# EAGLE design TTL640x480 (EAGLE 9.4.2)
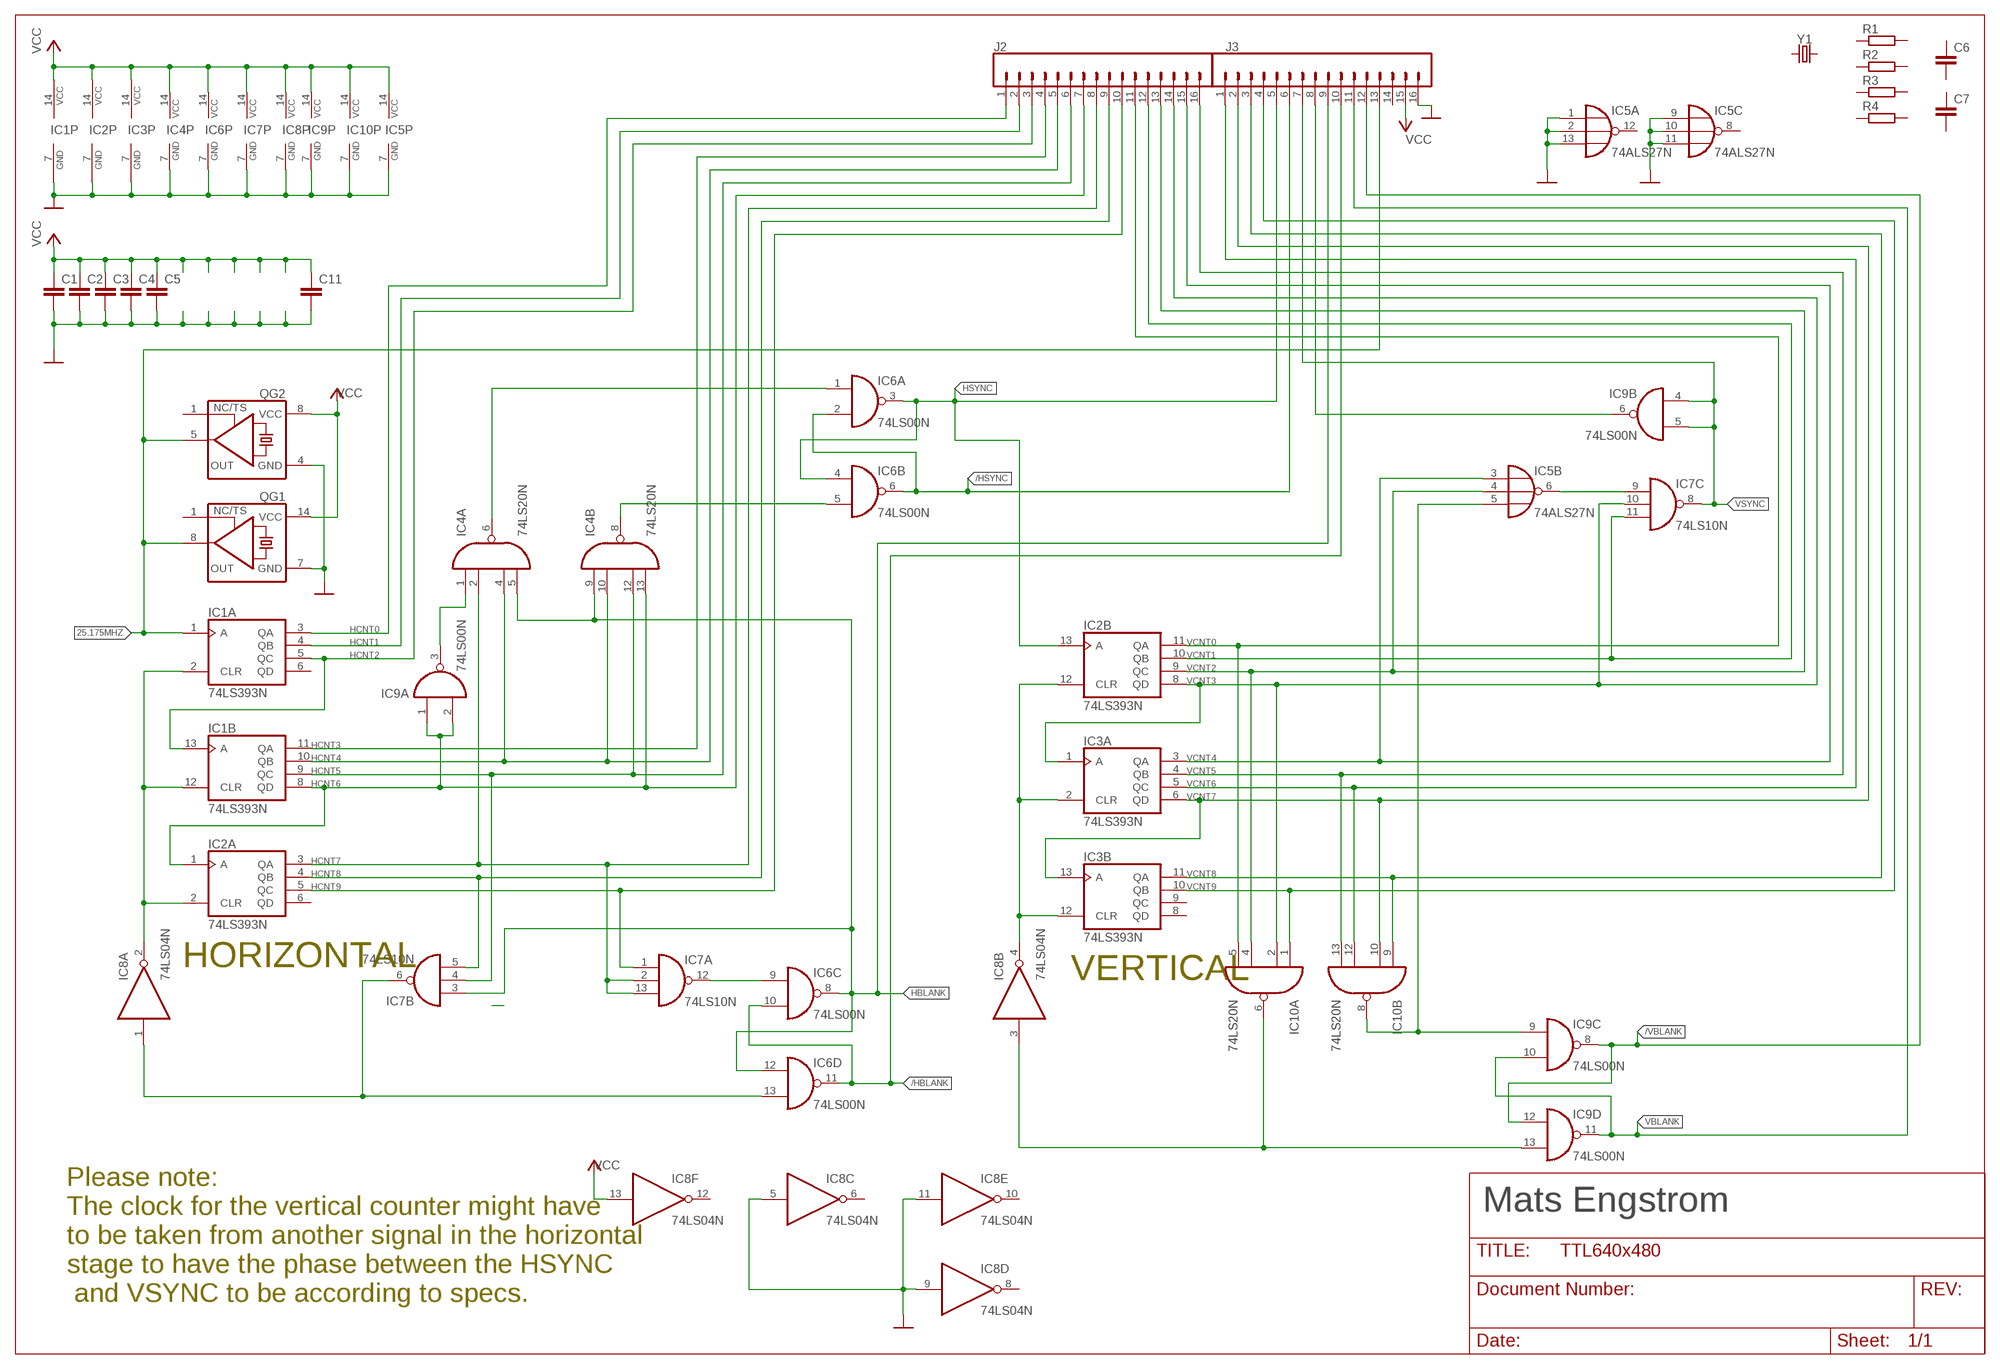
[diagram p0: schematic, sheet 1]

## Parts
C1  C-EU050-024X044  [C050-024X044]
C2  C-EU050-024X044  [C050-024X044]
C3  C-EU050-024X044  [C050-024X044]
C4  C-EU050-024X044  [C050-024X044]
C5  C-EU050-024X044  [C050-024X044]
C6  C-EU050-024X044  [C050-024X044]
C7  C-EU050-024X044  [C050-024X044]
C11  C-EU050-024X044  [C050-024X044]
IC1  74LS393N  [DIL14]
IC2  74LS393N  [DIL14]
IC3  74LS393N  [DIL14]
IC4  74LS20N  [DIL14]
IC5  74ALS27N  [DIL14]
IC6  74LS00N  [DIL14]
IC7  74LS10N  [DIL14]
IC8  74LS04N  [DIL14]
IC9  74LS00N  [DIL14]
IC10  74LS20N  [DIL14]
J2  CONN_16  [1X16]
J3  CONN_16  [1X16]
QG1  XO-14  [DIL14S]
QG2  XO-8  [DIL08S]
R1  R-EU_0204/2V  [0204V]
R2  R-EU_0204/2V  [0204V]
R3  R-EU_0204/2V  [0204V]
R4  R-EU_0204/2V  [0204V]
Y1  CRYSTALPTH-HC49US  [HC49US]

## Nets
25.175MHZ: IC1.1(A:A) J3.13 QG1.8(OUT) QG2.5(OUT)
/HBLANK: IC6.10(C:I1) IC6.11(D:O) J3.10
/HSYNC: IC6.2(A:I1) IC6.6(B:O) J3.6
/VBLANK: IC9.8(C:O) IC9.12(D:I0) J3.12
GND: C1.2 C2.2 C3.2 C4.2 C5.2 C11.2 IC1.7(P:GND) IC2.7(P:GND) IC3.7(P:GND) IC4.7(P:GND) IC5.1(A:I0) IC5.2(A:I1) IC5.7(P:GND) IC5.9(C:I0) IC5.10(C:I1) IC5.11(C:I2) IC5.13(A:I2) IC6.7(P:GND) IC7.7(P:GND) IC8.5(C:I) IC8.7(P:GND) IC8.9(D:I) IC8.11(E:I) IC9.7(P:GND) IC10.7(P:GND) J3.16 QG1.7(GND) QG2.4(GND)
HBLANK: IC4.5(A:I3) IC4.9(B:I0) IC6.8(C:O) IC6.12(D:I0) IC7.3(B:I0) J3.9
HCNT0: IC1.3(A:QA) J2.1
HCNT1: IC1.4(A:QB) J2.2
HCNT2: IC1.5(A:QC) IC1.13(B:A) J2.3
HCNT3: IC1.11(B:QA) J2.4
HCNT4: IC1.10(B:QB) IC4.4(A:I2) IC4.10(B:I1) J2.5
HCNT5: IC1.9(B:QC) IC4.12(B:I2) IC7.4(B:I1) J2.6
HCNT6: IC1.8(B:QD) IC2.1(A:A) IC4.13(B:I3) IC9.1(A:I0) IC9.2(A:I1) J2.7
HCNT7: IC2.3(A:QA) IC4.2(A:I1) IC7.2(A:I1) IC7.13(A:I2) J2.8
HCNT8: IC2.4(A:QB) IC7.5(B:I2) J2.9
HCNT9: IC2.5(A:QC) IC7.1(A:I0) J2.10
HSYNC: IC2.13(B:A) IC6.3(A:O) IC6.4(B:I0) J3.5
N$1: IC9.6(B:O) J3.8
N$2: IC4.1(A:I0) IC9.3(A:O)
N$3: IC1.2(A:CLR) IC1.12(B:CLR) IC2.2(A:CLR) IC8.2(A:O)
N$4: IC5.5(B:I2) IC9.9(C:I0) IC10.8(B:O)
N$5: IC5.6(B:O) IC7.9(C:I0)
N$6: IC2.12(B:CLR) IC3.2(A:CLR) IC3.12(B:CLR) IC8.4(B:O)
N$8: IC8.3(B:I) IC9.13(D:I1) IC10.6(A:O)
N$10: IC4.6(A:O) IC6.1(A:I0)
N$11: IC4.8(B:O) IC6.5(B:I1)
N$12: IC6.9(C:I0) IC7.12(A:O)
N$13: IC6.13(D:I1) IC7.6(B:O) IC8.1(A:I)
VBLANK: IC9.10(C:I1) IC9.11(D:O) J3.11
VCC: C1.1 C2.1 C3.1 C4.1 C5.1 C11.1 IC1.14(P:VCC) IC2.14(P:VCC) IC3.14(P:VCC) IC4.14(P:VCC) IC5.14(P:VCC) IC6.14(P:VCC) IC7.14(P:VCC) IC8.13(F:I) IC8.14(P:VCC) IC9.14(P:VCC) IC10.14(P:VCC) J3.15 QG1.14(VCC) QG2.8(VCC)
VCNT0: IC2.11(B:QA) IC10.5(A:I3) J2.11
VCNT1: IC2.10(B:QB) IC7.11(C:I2) J2.12
VCNT2: IC2.9(B:QC) IC5.4(B:I1) IC10.4(A:I2) J2.13
VCNT3: IC2.8(B:QD) IC3.1(A:A) IC7.10(C:I1) IC10.2(A:I1) J2.14
VCNT4: IC3.3(A:QA) IC5.3(B:I0) J2.15
VCNT5: IC3.4(A:QB) IC10.13(B:I3) J2.16
VCNT6: IC3.5(A:QC) IC10.12(B:I2) J3.1
VCNT7: IC3.6(A:QD) IC3.13(B:A) IC10.10(B:I1) J3.2
VCNT8: IC3.11(B:QA) IC10.9(B:I0) J3.3
VCNT9: IC3.10(B:QB) IC10.1(A:I0) J3.4
VSYNC: IC7.8(C:O) IC9.4(B:I0) IC9.5(B:I1) J3.7
Unconnected: C6.1 C6.2 C7.1 C7.2 IC1.6(A:QD) IC2.6(A:QD) IC3.8(B:QD) IC3.9(B:QC) IC5.8(C:O) IC5.12(A:O) IC8.6(C:O) IC8.8(D:O) IC8.10(E:O) IC8.12(F:O) J3.14 QG1.1(TS) QG2.1(TS) R1.1 R1.2 R2.1 R2.2 R3.1 R3.2 R4.1 R4.2 Y1.1 Y1.2

## Notes on the sheet
- HORIZONTAL
- VERTICAL
- Mats Engstrom
- Please note: 
  The clock for the vertical counter might have 
  to be taken from another signal in the horizontal 
  stage to have the phase between the HSYNC
   and VSYNC to be according to specs.

## Library data of the parts
C1-C7 C11 = rcl:C-EU: CAPACITOR, European symbol; SPICEPREFIX: C
IC1-IC3 = 74xx-us:74*393: Dual 4-bit decade and binary COUNTER
IC4 IC10 = 74xx-eu:74*20: Dual 4-input NAND gate
IC5 = 74xx-eu:74*27: Triple 3-input NOR gate
IC6 IC9 = 74xx-eu:74*00: Quad 2-input NAND gate
IC7 = 74xx-eu:74*10: Triple 3-input NAND gate
IC8 = 74xx-eu:74*04: Hex INVERTER
J2 J3 = SparkFun-Connectors:CONN_16: Multi connection point. Often used as Generic Header-pin footprint for 0.1 inch spaced/style header connections On any of the 0.1 inch spaced packages, you can populate with these: Break Away Headers - Straight <https://www.sparkfun.com/products/116> (PRT-00116) Break Away Male Headers - Right Angle <https://www.sparkfun.com/products/553> (PRT-00553) Female Headers <https://www.sparkfun.com/products/115> (PRT-00115) Break Away Headers - Machine Pin <https://www.sparkfun.com/products/117> (PRT-00117) Break Away Female Headers - Swiss Machine Pin <https://www.sparkfun.com/products/743> (PRT-00743) For SCREWTERMINALS and SPRING TERMINALS visit here: Screw Terimnals on SparkFun.com <https://www.sparkfun.com/search/results?term=Screw+Terminals> (5mm/3.5mm/2.54mm spacing) This device is also useful as a general connection point to wire up your design to another part of your project. Our various solder wires solder well into these plated through hole pads. Hook-Up Wire - Assortment (Stranded, 22 AWG) <https://www.sparkfun.com/products/11375> (PRT-11375) Hook-Up Wire - Assortment (Solid Core, 22 AWG) <https://www.sparkfun.com/products/11367> (PRT-11367) View the entire wire category on our website here <https://www.sparkfun.com/categories/141> Special notes: Molex polarized connector foot print use with SKU : PRT-08231 with associated crimp pins and housings. 1MM SMD Version SKU: PRT-10208 NOTES ON THE VARIANTS LOCK and LOCK_LONGPADS... This footprint was designed to help hold the alignment of a through-hole component (i.e. 6-pin header) while soldering it into place. You may notice that each hole has been shifted either up or down by 0.005 of an inch from it's more standard position (which is a perfectly straight line). This slight alteration caused the pins (the squares in the middle) to touch the edges of the holes. Because they are alternating, it causes a "brace" to hold the component in place. 0.005 has proven to be the perfect amount of "off-center" position when using our standard breakaway headers. Although looks a little odd when you look at the bare footprint, once you have a header in there, the alteration is very hard to notice. Also,if you push a header all the way into place, it is covered up entirely on the bottom side.
QG1 QG2 = crystal:XO-: CRYSTAL; OC_FARNELL: unknown; OC_NEWARK: unknown
R1-R4 = rcl:R-EU_: RESISTOR, European symbol; SPICEPREFIX: R
Y1 = SparkFun-Clocks:CRYSTAL: Crystals (Generic) These are passive quartz crystals, which can be used as a clock source for a microcontroller. Crystal's are two-terminal devices. They require external "load" capacitors to generate an oscillating signal.

## Board
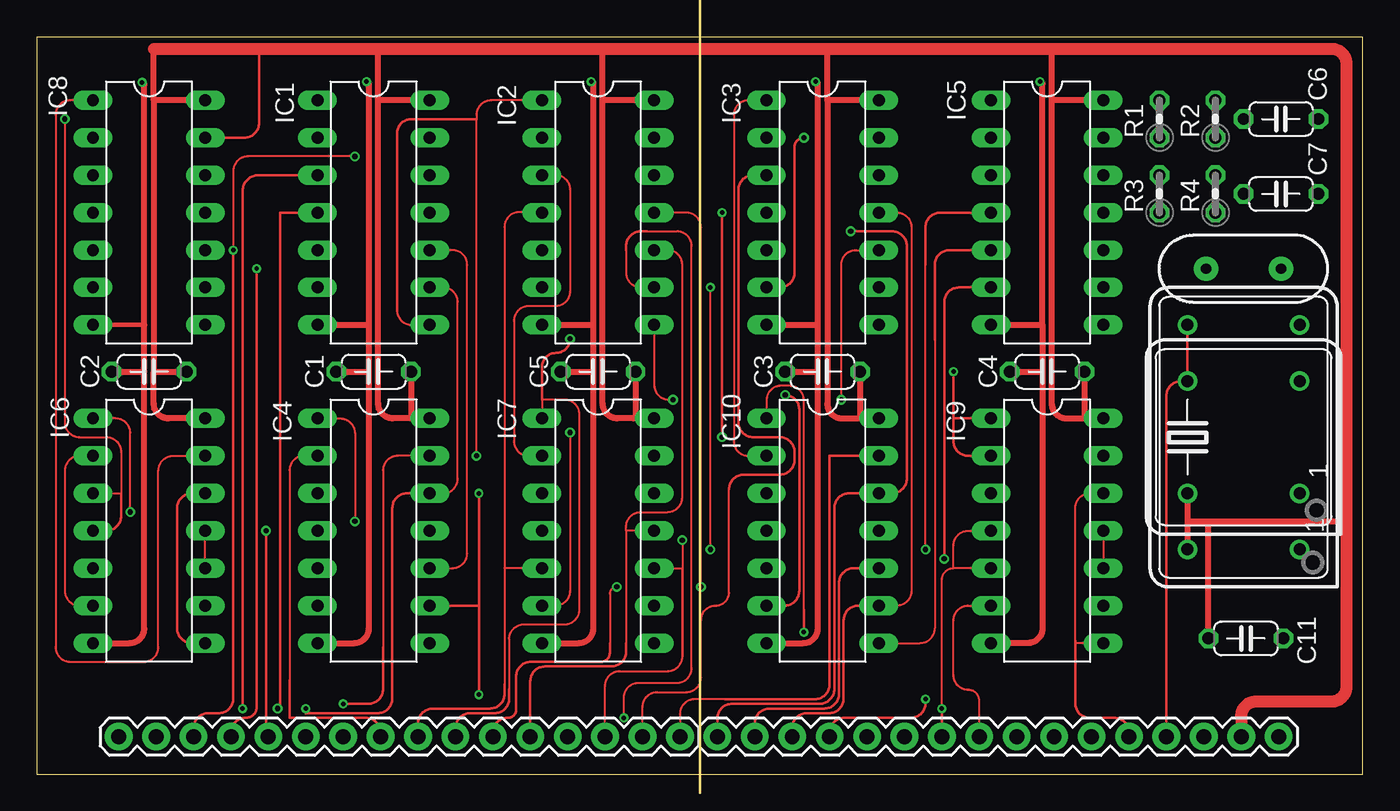
[diagram p1: board, top side]
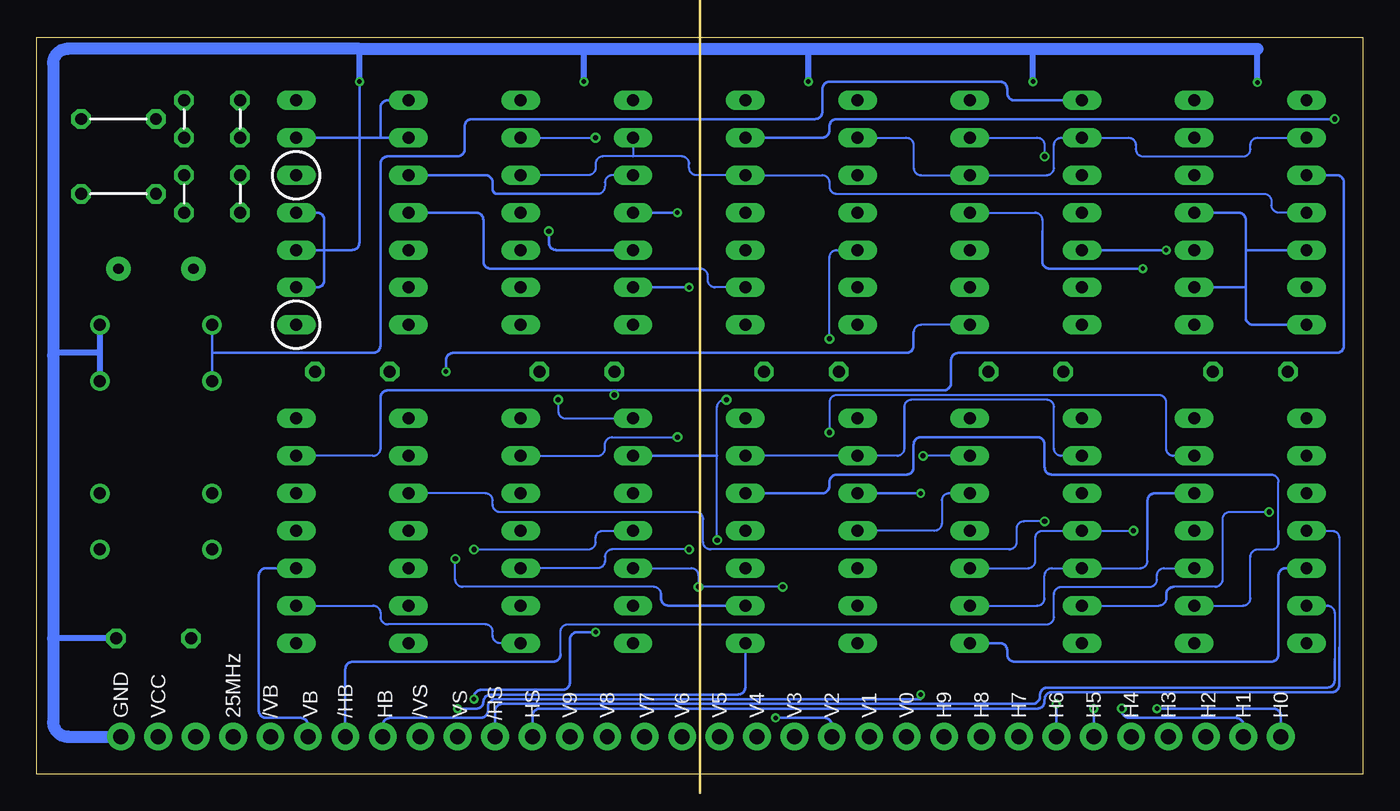
[diagram p2: board, bottom side, seen from below]

Size 90 x 50 mm. Coordinates in mm from the lower left corner, seen from the top.
Outline: 0,0 90,0 90,50 0,50 0,0
Copper layers (1*16): Top 0.035mm / dielectric 1.5mm / Bottom 0.035mm
Design rules "dirt_cheap_dirty_boards.v1.1": minimum track width 6mil, minimum drill 12mil, track to track 6mil, track to pad 6mil, pad to pad 6mil, via to via 6mil, smd to smd 0mil, copper to edge 10mil, drill to drill 10mil, minimum pad ring 10mil, minimum via ring 6mil, stop-mask expansion 2mil, vias tented up to drill 25mil, thermal gap 10mil
Milling: 1 lines

### Footprints (pad centres in the part's own frame; a part is rotated, then mirrored left to right if it is on the bottom)
C050-024X044 = drill 0.813 octagon: 1 -2.54,0; 2 2.54,0
DIL14 = drill 0.813 long: 1 -7.62,-3.81; 2 -5.08,-3.81; 3 -2.54,-3.81; 4 0,-3.81; 5 2.54,-3.81; 6 5.08,-3.81; 7 7.62,-3.81; 8 7.62,3.81; 9 5.08,3.81; 10 2.54,3.81; 11 0,3.81; 12 -2.54,3.81; 13 -5.08,3.81; 14 -7.62,3.81
1X16 = drill 1.016 pad 1.88: 1 0,0; 2 2.54,0; 3 5.08,0; 4 7.62,0; 5 10.16,0; 6 12.7,0; 7 15.24,0; 8 17.78,0; 9 20.32,0; 10 22.86,0; 11 25.4,0; 12 27.94,0; 13 30.48,0; 14 33.02,0; 15 35.56,0; 16 38.1,0
DIL14S = drill 0.813: 1 -7.62,-3.81; 7 7.62,-3.81; 8 7.62,3.81; 14 -7.62,3.81
DIL08S = drill 0.813: 1 -3.81,-3.81; 4 3.81,-3.81; 5 3.81,3.81; 8 -3.81,3.81
0204V = drill 0.813 octagon: 1 -1.27,0; 2 1.27,0
HC49US = drill 0.7 pad 1.651: 1 -2.54,0; 2 2.54,0

### Placement (x,y rotation side)
C1  22.86,27.3 180 top
C2  7.62,27.3 180 top
C3  53.34,27.3 180 top
C4  68.58,27.3 180 top
C5  38.1,27.3 180 top
C6  84.45,44.45 180 top
C7  84.45,39.37 0 top
C11  82.07,9.21 0 top
IC1  22.86,38.1 270 top
IC2  38.1,38.1 270 top
IC3  53.34,38.1 270 top
IC4  22.86,16.51 270 top
IC5  68.58,38.1 270 top
IC6  7.62,16.51 270 top
IC7  38.1,16.51 270 top
IC8  7.62,38.1 270 top
IC9  68.58,16.51 270 top
IC10  53.34,16.51 270 top
J2  5.56,2.54 0 top
J3  46.2,2.54 0 top
QG1  81.92,22.86 90 top
QG2  81.92,22.86 90 top
R1  76.2,44.45 90 top
R2  80.01,44.45 90 top
R3  76.2,39.37 90 top
R4  80.01,39.37 90 top
Y1  81.92,34.29 180 top

### Tracks (layer width: path | path; a pad name or v marks a point on that pad's centre or on a via)
25.175MHZ
  Top 0.159: QG1.8 QG2.5 77.68,26.67 arc90 76.68,25.67 J3.13
  Bottom 0.159: IC1.1 23.63,45.72 arc90 24.13,46.22 24.13,46.49 arc-90 24.63,46.99 36.17,46.99 arc-90 36.67,46.49 36.67,44.95 arc90 37.17,44.45 60.46,44.45 arc-90 60.96,43.95 60.96,42.41 arc90 61.46,41.91 66.17,41.91 arc-90 66.67,41.41 66.67,29.07 arc90 67.17,28.57 78.11,28.57 | 78.11,28.57 QG2.5 | 78.11,28.57 QG1.8
/HBLANK
  Top 0.152: IC6.10 IC6.11
  Bottom 0.152: IC6.10 13.47,13.97 arc-90 13.97,13.47 13.97,13.2 arc90 14.47,12.7 20.45,12.7 arc-90 20.95,12.2 20.95,10.66 arc90 21.45,10.16 53.95,10.16 arc-90 54.45,9.66 54.45,8.12
  Bottom 0.159: 54.45,8.12 arc90 54.95,7.62 68.56,7.62 arc-90 69.06,7.12 J3.10
/HSYNC
  Top 0.152: IC6.6 2.9,11.43 arc-90 1.91,12.43 1.91,20.59 arc-90 2.9,21.59 IC6.2
  Bottom 0.152: IC6.6 2.4,11.43 arc90 1.91,10.93 1.91,7.8
  Bottom 0.159: J3.6 58.9,4.26 arc90 58.4,4.76 22.4,4.76 arc-90 21.9,5.26 21.9,5.37 arc90 21.4,5.87 2.4,5.87 arc-90 1.91,6.37 1.91,7.8
/VBLANK
  Top 0.152: IC9.12 71.48,19.05 arc90 70.48,18.05 70.48,9.05 70.48,8.89 IC9.8
  Top 0.159: 70.48,9.05 70.48,4.81 arc90 71.48,3.81 73.14,3.81 arc-90 74.14,2.81 J3.12
GND  (via drill 0.3)
  Top 0.305: IC8.7 7.3,30.48
  Top 0.406: IC6.7 6.3,8.89 arc90 7.3,9.89 7.3,27.3 | 7.3,27.3 7.3,30.48 7.3,46.77 arc90 v7.14,46.93 | IC4.7 21.54,8.89 arc90 22.54,9.89 22.54,27.3 | 22.54,27.3 22.54,30.48 | IC7.7 36.78,8.89 arc90 37.78,9.89 37.78,27.3 | 37.78,27.3 37.78,30.48 | IC10.7 52.02,8.89 arc90 53.02,9.89 53.02,27.3 | 53.02,27.3 53.02,30.48 | IC1.7 22.54,30.48 | IC2.7 37.78,30.48 | IC3.7 53.02,30.48 | 68.26,27.3 68.26,9.89 arc-90 67.26,8.89 IC9.7 | 68.26,30.48 68.26,27.3 | C2.2 7.3,27.3 | C1.2 22.54,27.3 | C5.2 37.78,27.3 | C3.2 53.02,27.3 | C4.2 68.26,27.3 | IC5.7 68.26,30.48 | 68.26,30.48 68.26,46.83 arc90 v68.1,46.99 | 53.02,30.48 53.02,46.83 arc90 v52.86,46.99 | 37.78,30.48 37.78,46.83 arc90 v37.62,46.99 | 22.54,30.48 22.54,46.83 arc90 v22.38,46.99
  Bottom 0.159: 88.9,28.57 88.9,28.42 | IC8.11 8.44,38.1 arc90 7.94,37.6 7.94,35.56 | 7.94,35.56 7.94,33.02 | 7.94,33.02 IC8.9 | IC8.7 7.44,30.48 arc90 7.94,30.98 7.94,33.02 | IC8.5 7.94,35.56 | IC5.11 70.98,38.1 arc90 70.48,37.6 70.48,35.56 | 70.48,35.56 70.48,33.52 arc90 70.98,33.02 IC5.9 | IC5.10 70.48,35.56 | IC5.1 66.17,45.72 arc-90 66.67,45.22 66.67,43.18 | 66.67,43.18 IC5.2 | IC5.13 68.1,43.18 | 68.1,43.18 66.67,43.18 | v68.1,46.99 68.1,43.18 | 70.48,35.56 68.6,35.56 arc-90 68.1,36.06 68.1,43.18
  Bottom 0.406: v68.1,46.99 68.1,49.21 | v52.86,46.99 52.86,49.21 | v37.62,46.99 37.62,49.21 | v22.38,46.99 22.38,49.21 | v7.14,46.93 7.14,49.21 | QG1.7 85.72,28.57 | 85.72,28.57 QG2.4 | 85.72,28.57 88.9,28.57 | C11.2 88.9,9.21
  Bottom 0.813: 7.14,49.21 22.38,49.21 37.62,49.21 52.86,49.21 68.1,49.21 87.9,49.21 arc-90 88.9,48.21 88.9,28.42 88.9,9.21 88.9,3.54 arc-90 87.9,2.54 J3.16
HBLANK  (via drill 0.3)
  Top 0.159: IC6.12 10.53,19.05 arc90 9.53,18.05 9.53,9.89 arc90 10.53,8.89 IC6.8 | v30,19.05 30,11.43 | 30,11.43 v30,5.4 | IC4.9 30,11.43
  Bottom 0.152: 14.61,15.24 14.61,14.47 arc90 15.11,13.97 IC4.5 21.09,13.97 arc-90 21.59,13.47 21.59,11.93 arc90 22.09,11.43 IC4.9
  Bottom 0.159: IC6.12 14.11,19.05 arc-90 14.61,18.55 14.61,15.24 | v30,19.05 IC7.3 | J3.9 66.52,3.31 arc90 66.02,3.81 59.87,3.81 arc-90 59.37,4.31 59.37,4.58 arc90 58.87,5.08 30,5.08 v30,5.4
HCNT0  (via drill 0.3)
  Top 0.159: IC1.3 14.97,40.64 arc90 13.97,39.48 v13.97,4.45
  Bottom 0.159: v13.97,4.45 6.06,4.45 arc90 5.56,3.94 J2.1
HCNT1  (via drill 0.35)
  Top 0.152: IC1.4 18.89,38.1
  Top 0.159: v16.35,4.45 16.51,4.45 16.51,38.1 18.89,38.1
  Bottom 0.159: v16.35,4.45 16.35,4.31 arc-90 15.85,3.81 8.6,3.81 arc90 8.1,3.31 J2.2
HCNT2  (via drill 0.3, 0.35)
  Top 0.152: v21.59,41.91 14.34,41.91 arc90 13.34,40.91 v13.34,35.56
  Top 0.159: J2.3 10.64,3.13 arc-90 11.64,4.13 12.34,4.13 arc90 13.34,5.13 v13.34,35.56
  Bottom 0.152: IC1.13 22.09,43.18 arc90 21.59,42.68 v21.59,41.91
  Bottom 0.159: IC1.5 v13.34,35.56
HCNT3  (via drill 0.3)
  Top 0.159: J2.4 13.18,2.81 arc-90 14.18,3.81 arc90 14.92,4.56 v14.92,34.29
  Bottom 0.152: IC1.11 22.25,38.1 arc90 21.75,37.6 21.75,36.83
  Bottom 0.159: 21.75,36.83 21.75,34.79 arc-90 21.25,34.29 v14.92,34.29
HCNT4  (via drill 0.35)
  Top 0.152: IC1.10 28.21,35.56 arc-90 29.21,34.56 29.21,14.97 arc-90 28.21,13.97 IC4.10
  Top 0.159: J2.5 15.56,2.54 v15.56,16.51
  Bottom 0.152: v15.56,16.51 IC4.4 21.73,16.51 arc-90 22.23,16.01 22.23,14.47 arc90 22.73,13.97 IC4.10
HCNT5  (via drill 0.3)
  Top 0.152: IC1.9 27.57,33.02 arc-90 28.57,32.02 28.57,20.05 arc-90 27.57,19.05 IC4.12
  Top 0.159: IC4.12 25.13,19.05 arc90 24.13,18.05 24.13,5.13 arc-90 23.13,4.13 18.26,4.13 v18.26,4.45
  Bottom 0.152: IC7.4 29.07,16.51 arc-90 28.57,17.01 28.57,18.55 arc90 28.07,19.05 IC4.12
  Bottom 0.159: v18.26,4.45 J2.6
HCNT6  (via drill 0.3, 0.35)
  Top 0.152: IC4.13 24.5,21.59 arc90 23.5,20.59 23.5,8.62 | IC2.1 30.84,45.72 arc90 29.84,44.72 29.84,44.45 v29.84,21.59 | 24.45,31.48 arc90 25.45,30.48 IC1.8
  Top 0.159: IC9.2 63.23,21.59 arc-90 62.23,22.59 62.23,24.13 | 62.23,24.13 v62.23,27.3 | IC9.1 62.23,24.13 | 29.84,44.45 25.45,44.45 arc90 24.45,43.45 24.45,31.48 | 23.5,8.62 23.5,5.76 arc-90 22.5,4.76 v20.8,4.76
  Bottom 0.152: IC1.8 29.98,30.48 arc-90 30.48,29.98 | IC4.13 v29.84,21.59
  Bottom 0.159: 30.48,29.98 30.48,29.07 arc90 30.98,28.57 61.73,28.57 arc-90 62.23,28.07 v62.23,27.3 | J2.7 v20.8,4.76
HCNT7
  Top 0.152: IC7.2 33.38,21.59 arc-90 32.38,22.59 32.38,30.75 arc-90 33.38,31.75 35.2,31.75 arc90 36.2,32.75 36.2,39.66 arc89 35.22,40.66 34.29,40.68 arc-180 IC2.3 | IC4.2 18.14,21.59 arc90 17.14,20.59 17.14,6.35
  Top 0.159: 17.14,6.35 17.14,3.81 22.34,3.81 arc-90 23.34,2.81 J2.8
  Bottom 0.152: IC7.13 IC7.2 31.61,21.59 arc-90 31.11,22.09 | IC4.2 20.45,21.59 arc90 20.95,22.09 20.95,24.9 arc-90 21.45,25.4 30.61,25.4 arc-90 31.11,24.9
  Bottom 0.159: 31.11,24.9 31.11,22.09
HCNT8
  Top 0.152: 31.75,13.97 31.75,6.08 | IC7.5 31.75,13.97 | IC2.4 34.29,38.14 32.75,38.14 arc90 31.75,37.14 31.75,13.97
  Top 0.159: 31.75,6.08 31.75,5.45 arc-90 30.75,4.45 26.88,4.45 arc90 25.88,3.44 J2.9
HCNT9  (via drill 0.35)
  Top 0.152: 32.07,5.76 32.07,9.16 arc-90 33.07,10.16 35.83,10.16 arc90 36.83,11.16 36.83,24.4 arc90 35.83,25.4 34.29,25.4 IC7.1
  Top 0.159: v36.2,29.53 arc-90 35.24,28.57 arc90 34.29,27.62 34.29,25.4 | 32.07,5.76 32.07,5.13 arc-90 31.07,4.13 29.42,4.13 arc90 28.42,3.13 J2.10
  Bottom 0.152: v36.2,29.53 36.2,35.06 arc90 35.7,35.56 IC2.5
HSYNC  (via drill 0.35)
  Top 0.152: IC6.3 5.71,19.05 5.71,21.86 arc90 4.71,22.86 2.9,22.86 arc-90 1.91,23.86 v1.91,44.45
  Top 0.159: IC6.4 4.71,16.51 arc90 5.71,17.51 5.71,19.05
  Bottom 0.152: IC6.4 2.09,16.51 arc90 1.59,16.01 1.59,8.57
  Bottom 0.159: v1.91,44.45 35.7,44.45 arc-90 36.2,43.95 36.2,43.68 arc90 36.7,43.18 IC2.13 | J3.5 56.36,3.94 arc90 55.86,4.45 22.09,4.45 arc-90 21.59,4.95 21.59,5.06 arc90 21.09,5.56 2.09,5.56 arc-90 1.59,6.06 1.59,8.57
N$1
  Top 0.152: J3.8 63.98,4.97 arc90 63.23,5.71 arc-90 62.23,6.71 62.23,10.43 arc-90 63.23,11.43 IC9.6
N$2  (via drill 0.35)
  Top 0.152: IC4.1 20.59,24.13 arc-90 21.59,23.13 v21.59,17.14
  Bottom 0.152: IC9.3 59.55,19.05 arc90 59.05,18.55 59.05,18.28 arc-90 58.55,17.78 45.27,17.78 arc90 44.77,17.28 44.77,15.74 arc-90 44.27,15.24 24,15.24 arc-90 23.5,15.74 23.5,16.64 arc90 23,17.14 v21.59,17.14
N$3
  Bottom 0.152: IC2.2 30.98,43.18 arc90 30.48,42.68 30.48,41.14 arc-90 29.98,40.64 IC1.12 21.45,40.64 arc-90 20.95,41.14 20.95,42.68 arc90 20.45,43.18 IC1.2 15.9,43.18 arc90 15.4,42.68 15.4,42.41 arc-90 14.9,41.91 8.12,41.91 arc-90 7.62,42.41 7.62,42.68 arc90 7.12,43.18 IC8.2
N$4
  Top 0.152: 60.96,29.48 60.96,9.89 arc-90 59.96,8.89 IC10.8
  Top 0.159: IC5.5 61.96,35.56 arc90 60.96,34.56 60.96,29.48
  Bottom 0.152: IC10.8 58.55,8.89 arc90 59.05,9.39 59.05,9.66 arc-90 59.55,10.16 66.17,10.16 arc90 66.67,10.66 66.67,10.93 arc-90 67.17,11.43 IC9.9
N$5  (via drill 0.35)
  Top 0.159: v61.59,14.61 61.59,32.02 arc-90 62.59,33.02 IC5.6
  Bottom 0.152: 47.62,12.2 arc-90 48.12,12.7 61.09,12.7 arc90 61.59,13.2 v61.59,14.61
  Bottom 0.159: IC7.9 47.12,11.43 arc90 47.62,11.93 47.62,12.2
N$6
  Bottom 0.152: 49.53,41.91 46.22,41.91 arc90 45.72,41.41 45.72,41.14 arc-90 45.22,40.64 IC2.12 36.7,40.64 arc90 36.2,40.14 36.2,39.87 arc-90 35.7,39.37 6.69,39.37 arc90 6.19,38.87 6.19,38.6 arc-90 5.69,38.1 IC8.4 | 49.53,41.91 51.57,41.91 arc-90 52.07,41.41 52.07,41.14 arc90 52.57,40.64 IC3.12 | IC3.2 49.53,41.91
N$8  (via drill 0.35)
  Top 0.159: IC10.6 50.75,11.43 arc90 51.75,12.43 51.75,24.77 arc90 v50.8,25.72
  Bottom 0.152: 66.67,22.09 arc90 67.17,21.59 IC9.13
  Bottom 0.159: 50.8,26.04 28.44,26.04 arc-90 27.94,26.54 27.94,28.07 arc90 27.44,28.57 1.77,28.57 arc-90 1.27,29.07 1.27,40.14 arc-90 1.77,40.64 IC8.3 | v50.8,25.72 50.8,26.04 | 66.67,22.09 66.67,25.54 arc90 66.17,26.04 50.8,26.04
N$10  (via drill 0.35)
  Top 0.152: v6.35,17.78 6.35,23.13 arc90 5.35,24.13 IC6.1
  Bottom 0.152: IC4.6 13.84,11.43 arc-90 13.34,11.93 | v6.35,17.78 9.03,17.78 arc-90 9.53,17.28 9.53,13.2 arc90 10.03,12.7 12.84,12.7
  Bottom 0.159: 12.84,12.7 arc-90 13.34,12.2 13.34,11.93
N$11
  Bottom 0.159: IC6.5 5.21,13.97 arc-90 5.71,13.47 5.71,8.12 arc90 6.21,7.62 23.63,7.62 arc90 24.13,8.12 24.13,8.39 arc-90 24.63,8.89 IC4.8
N$12
  Bottom 0.152: 5.71,16.51 5.71,19.82 arc-90 6.21,20.32 | IC6.9 8.12,11.43 arc-90 7.62,11.93 7.62,14.74 arc90 7.12,15.24 6.17,15.24 arc-90 5.71,15.69
  Bottom 0.159: IC7.12 36.7,19.05 arc-90 36.2,19.55 36.2,19.82 arc90 35.7,20.32 30.98,20.32 arc-90 30.48,20.82 30.48,22.36 arc90 29.98,22.86 22.09,22.86 arc90 21.59,22.36 21.59,20.82 arc-90 21.09,20.32 6.21,20.32 | 5.71,15.69 5.71,16.51
N$13  (via drill 0.35)
  Top 0.152: IC8.1 2.27,45.72 arc90 1.27,44.72 1.27,8.62 arc90 2.27,7.62 7.25,7.62 arc90 8.26,8.62 8.26,20.59 arc-90 9.26,21.59 IC6.13 | v36.2,23.18 36.2,12.43 arc-90 35.2,11.43 IC7.6
  Bottom 0.152: v36.2,23.18 36.2,25.22 arc90 35.7,25.72 13.84,25.72 arc90 13.34,25.22 13.34,22.09 arc-90 12.84,21.59 IC6.13
VBLANK
  Top 0.152: IC9.11 IC9.10
  Bottom 0.152: 73.8,13.97 IC9.10
  Bottom 0.159: J3.11 71.6,3.31 arc-90 72.1,3.81 74.43,3.81 arc90 74.93,4.31 74.93,13.47 arc90 74.43,13.97 73.8,13.97
VCC
  Top 0.159: IC8.13 14.08,43.18 arc90 15.08,44.18 15.08,49.21
  Top 0.406: IC10.14 55.88,24.13 | 53.66,45.72 53.66,25.13 arc90 54.66,24.13 55.88,24.13 | IC7.14 40.48,24.13 | 40.48,24.13 39.42,24.13 arc-90 38.42,25.13 38.42,45.72 | IC4.14 25.4,24.13 | 25.4,24.13 24.18,24.13 arc-90 23.18,25.13 23.18,45.72 | IC6.14 8.94,24.13 arc-90 7.94,25.13 7.94,27.3 | 7.94,45.72 7.94,27.3 | IC9.14 71.12,24.13 | 68.9,45.72 68.9,25.13 arc90 69.9,24.13 71.12,24.13 | 7.94,27.3 C2.1 | C3.1 55.88,24.13 | C1.1 25.4,24.13 | C5.1 40.64,24.29 40.48,24.13 | C4.1 71.12,24.13 | IC5.14 68.9,45.72 | IC3.14 53.66,45.72 | IC2.14 38.42,45.72 | IC1.14 23.18,45.72 | IC8.14 7.94,45.72 | 68.9,45.72 68.9,49.21 69.06,49.21 | 7.94,45.72 7.94,49.21 | 23.18,45.72 23.18,49.21 | 38.42,45.72 38.42,49.21 | 53.66,45.72 53.66,49.21 | QG2.8 78.11,17.14 | 78.11,17.14 QG1.14 | 78.11,17.14 79.53,17.14 | 79.53,17.14 88.9,17.14 | C11.1 79.53,17.14
  Top 0.813: 7.94,49.21 15.08,49.21 23.18,49.21 38.42,49.21 53.66,49.21 69.06,49.21 87.9,49.21 arc-90 88.9,48.21 88.9,17.14 88.9,5.92 arc-90 87.9,4.92 82.76,4.92 arc90 81.76,3.92 J3.15
VCNT0  (via drill 0.35)
  Top 0.152: v39.37,12.7 arc90 38.89,12.22 38.89,8.89 | v45.09,12.7 45.09,37.1 arc90 44.09,38.1 IC2.11
  Top 0.159: 38.89,8.89 38.89,8.21 arc-90 38.31,7.62 33.54,7.62 arc90 32.54,6.62 32.54,4.4 arc-90 31.96,3.81 arc90 30.96,2.81 J2.11
  Bottom 0.152: v39.37,12.7 v45.09,12.7 45.09,13.47 arc-90 45.59,13.97 IC10.5
VCNT1
  Top 0.152: IC7.11 40.01,16.51 | 40.01,16.51 40.01,8.89 | IC2.10 42.81,35.56 arc-90 43.81,34.56 43.81,18.78 arc-90 42.81,17.78 41.01,17.78 arc90 40.01,16.78 40.01,16.51
  Top 0.159: 40.01,8.89 40.01,8.3 arc-90 39.01,7.3 34.5,7.3 arc90 33.5,6.3 J2.12
VCNT2  (via drill 0.3, 0.35)
  Top 0.152: v60.33,15.24 60.33,34.56 | 41.43,36.83 43.45,36.83 arc-90 44.45,35.83 44.45,7.19 arc-90 43.45,6.19 40.85,6.19 arc90 39.85,5.19 v39.85,3.81 | 40.01,35.56 40.01,34.02 arc90 41.01,33.02 IC2.9
  Top 0.159: 40.01,35.56 40.01,35.83 arc-90 41.01,36.83 41.43,36.83 | 60.33,34.56 60.33,37.1 arc-90 61.33,38.1 IC5.4
  Bottom 0.152: v60.33,15.24 52.57,15.24 arc-90 52.07,15.74 52.07,16.01 arc90 51.57,16.51 IC10.4 | IC2.9 43.95,33.02 arc90 44.45,33.52 44.45,33.79 arc-90 44.95,34.29
  Bottom 0.159: 44.95,34.29 59.19,34.29 arc90 59.69,34.79 59.69,37.6 arc-90 60.19,38.1 IC5.4 | v39.85,3.81 36.54,3.81 arc90 36.04,3.31 J2.13
VCNT3  (via drill 0.35)
  Top 0.152: IC3.1 48.31,45.72 arc90 47.31,44.72 47.31,22.59 arc90 48.31,21.59 IC10.2 | IC7.10 43.81,13.97 v43.82,15.87 v43.81,15.88 | IC2.8 41.91,26.4 arc90 42.91,25.4 v43.18,25.4 | J2.14 38.58,5.99 arc-90 39.58,6.99 42.82,6.99 arc90 43.82,7.99
  Top 0.159: 43.82,7.99 43.81,13.97
  Bottom 0.152: v43.81,15.88 43.81,21.59 43.81,24.9 arc90 43.31,25.4 v43.18,25.4
  Bottom 0.159: IC10.2 43.81,21.59
VCNT4
  Top 0.152: J2.15 41.12,4.56 arc-90 42.12,5.56 44.09,5.56 arc90 45.09,6.56 45.09,10.43 arc-90 46.09,11.43 arc90 46.99,12.34 46.99,19.32
  Top 0.159: IC3.3 48.62,40.64 arc90 47.62,39.64 47.62,23.86 arc90 48.62,22.86 50.44,22.86 arc-90 51.44,21.86 51.44,21.32 arc-90 50.44,20.32 47.99,20.32 arc90 46.99,19.32 | J2.15 41.12,3.13
  Bottom 0.152: 51.94,39.37 arc-90 51.44,39.87 51.44,40.14 arc90 50.94,40.64 IC3.3
  Bottom 0.159: 51.94,39.37 58.76,39.37 arc90 59.05,39.66 59.05,40.14 arc-90 59.55,40.64 IC5.3
VCNT5  (via drill 0.3, 0.35)
  Top 0.152: 46.72,5.08 44.66,5.08 arc90 43.66,4.08 43.66,2.7
  Top 0.159: v46.51,22.86 v46.51,38.1 | J2.16 43.66,2.7 43.66,2.81 | 46.72,5.08 52.82,5.08 arc90 53.82,6.08 53.82,21.59 IC10.13
  Bottom 0.152: v46.51,22.86 50.94,22.86 arc-90 51.44,22.36 51.44,22.09 arc90 51.94,21.59 IC10.13
  Bottom 0.159: v46.51,38.1 IC3.4
VCNT6  (via drill 0.35)
  Top 0.159: v55.24,36.83 58.05,36.83 arc-90 59.05,35.83 59.05,20.05 arc-90 58.05,19.05 IC10.12 55.13,19.05 arc90 54.13,18.05 54.13,5.77 arc-90 53.13,4.77 47.2,4.77 arc90 46.2,3.77 J3.1
  Bottom 0.159: IC3.5 54.74,35.56 arc90 55.24,36.06 v55.24,36.83
VCNT7  (via drill 0.3, 0.35)
  Top 0.152: v45.72,15.24 v45.72,33.02
  Top 0.159: IC3.6 50.44,33.02 arc90 51.44,34.02 51.44,42.55 arc-90 v52.07,43.18 | J3.2 48.74,3.44 arc-90 49.74,4.45 53.45,4.45 arc90 54.45,5.45 54.45,12.97 arc-90 55.45,13.97 IC10.10
  Bottom 0.152: IC3.13 v52.07,43.18 | IC10.10 51.94,13.97 arc-90 51.44,14.47 51.44,14.74 arc90 50.94,15.24 v45.72,15.24
  Bottom 0.159: v45.72,33.02 IC3.6
VCNT8
  Top 0.152: IC3.11 58.37,38.1 arc-90 59.37,37.1 59.37,12.43 arc-90 58.37,11.43 IC10.9
  Top 0.159: J3.3 51.28,3.13 arc-90 52.28,4.13 53.77,4.13 arc90 54.77,5.13 54.77,10.43 arc-90 55.77,11.43 IC10.9
VCNT9  (via drill 0.3, 0.35)
  Top 0.152: 52.07,11.16 52.07,25.35 arc90 51.07,26.35 50.53,26.35 arc90 49.53,25.35 IC10.1 | v54.61,25.4 54.61,34.56 arc-90 55.61,35.56 IC3.10
  Top 0.159: J3.4 53.82,2.81 arc-90 54.82,3.81 59.33,3.81 arc90 60.33,4.81 v60.33,5.08 | v52.07,9.63 52.07,11.16
  Bottom 0.152: v54.61,25.4 54.61,24.63 arc-90 54.11,24.13 IC10.1
  Bottom 0.159: v52.07,9.63 53.32,9.63 arc-90 53.82,9.13 53.82,6.21 arc90 54.32,5.71 59.83,5.71 arc-90 60.33,5.21 v60.33,5.08
VSYNC  (via drill 0.3)
  Top 0.152: 62.23,13.97 62.23,15.51 arc-90 63.23,16.51 IC9.4 | IC9.5 62.23,13.97 | v61.44,4.45 61.44,13.18 arc-90 62.23,13.97
  Top 0.159: J3.7 v61.44,4.45
  Bottom 0.159: IC7.8 41.91,5.9 arc90 42.41,5.4 59.19,5.4 arc-90 59.69,4.9 arc90 60.14,4.45 v61.44,4.45

### Text on the board
bPlace: H0 | H1 | H2 | H3 | H4 | H5 | H6 | H7 | H8 | H9 | V0 | V1 | V2 | V3 | V4 | V5 | V6 | V7 | V8 | V9 | HS | /HS | VS | /VS | HB | /HB | VB | /VB | 25MHz | VCC | GND